# Altium project Visual_tactile.PrjPcb (part 3 of 3)

## Sheet memory.SchDoc
size A4; SheetNumber: 3; SheetTotal: 6
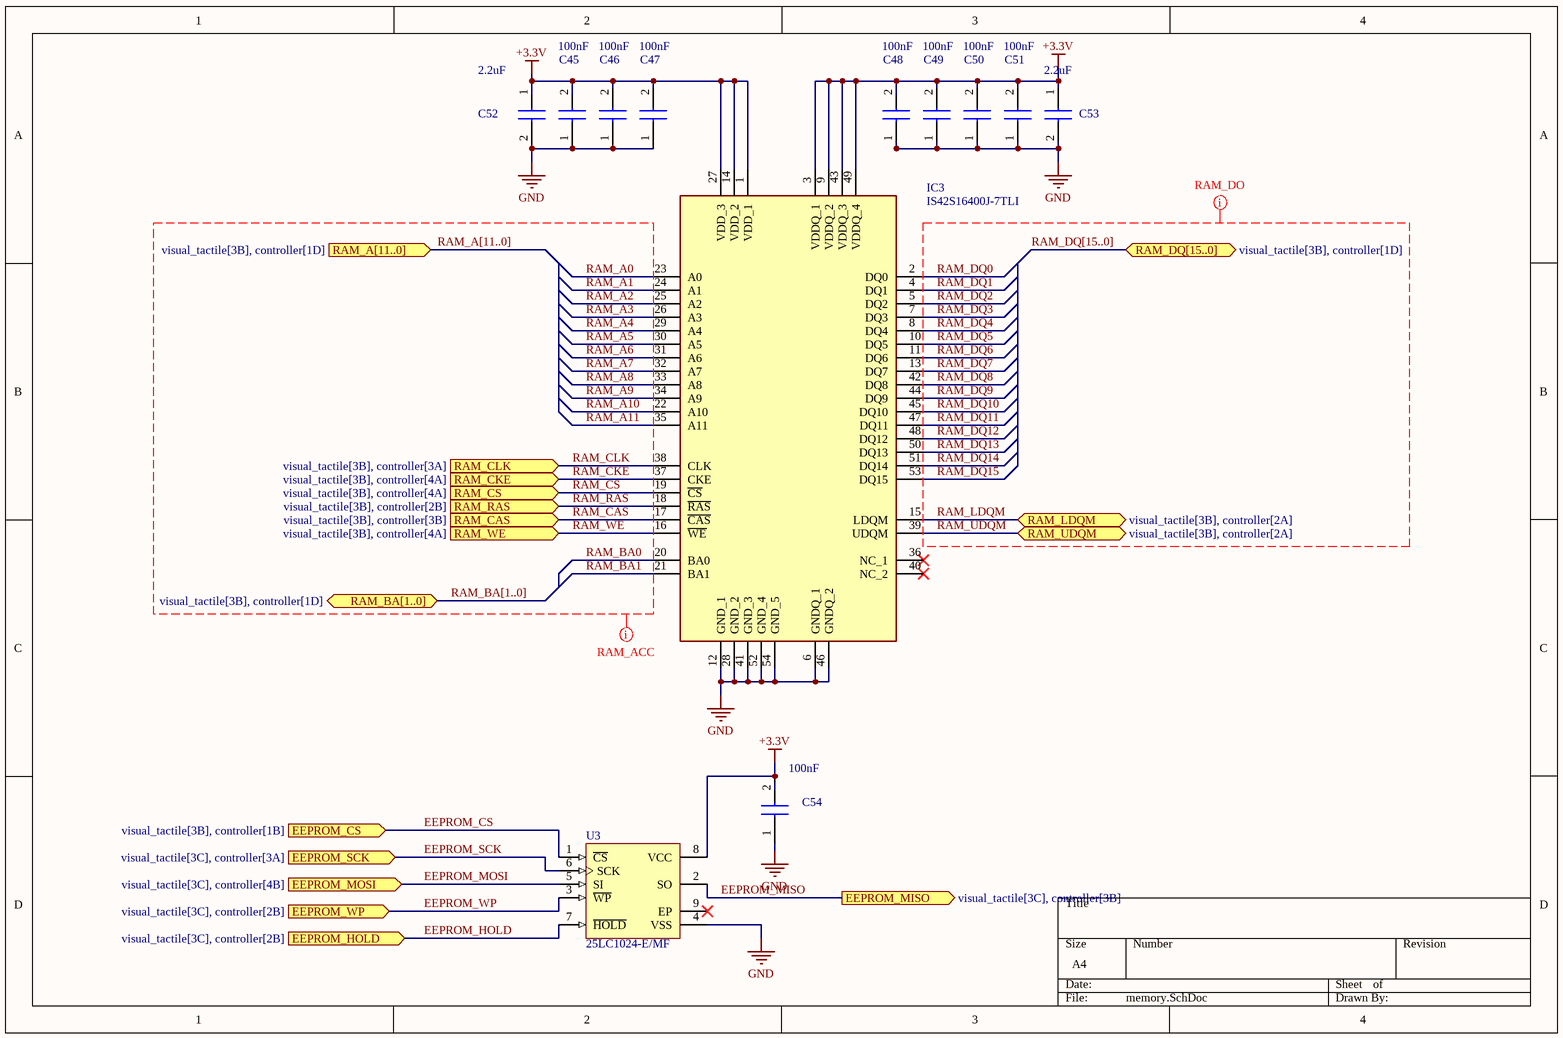
[diagram p5: memory.SchDoc]

### Parts
C45  value 100nF  [CAPC1608X87N]  (hidden comment: CGA3E2X7R1H104K080AA)
C46  value 100nF  [CAPC1608X87N]  (hidden comment: CGA3E2X7R1H104K080AA)
C47  value 100nF  [CAPC1608X87N]  (hidden comment: CGA3E2X7R1H104K080AA)
C48  value 100nF  [CAPC1608X87N]  (hidden comment: CGA3E2X7R1H104K080AA)
C49  value 100nF  [CAPC1608X87N]  (hidden comment: CGA3E2X7R1H104K080AA)
C50  value 100nF  [CAPC1608X87N]  (hidden comment: CGA3E2X7R1H104K080AA)
C51  value 100nF  [CAPC1608X87N]  (hidden comment: CGA3E2X7R1H104K080AA)
C52  value 2.2uF  [CAPC1608X87N]  (hidden comment: 06036C225KAT2A)
C53  value 2.2uF  [CAPC1608X87N]  (hidden comment: 06036C225KAT2A)
C54  value 100nF  [CAPC1608X87N]  (hidden comment: CGA3E2X7R1H104K080AA)
IC3  IS42S16400J-7TLI  [SOP80P1176X120-54N]
U3  25LC1024-E/MF  [DFNS-MF8]

### Ports
EEPROM_CS (in, see visual_tactile[3B], controller[1B]), EEPROM_HOLD (in, see visual_tactile[3C], controller[2B]), EEPROM_MISO (out, see visual_tactile[3C], controller[3B]), EEPROM_MOSI (in, see visual_tactile[3C], controller[4B]), EEPROM_SCK (in, see visual_tactile[3C], controller[3A]), EEPROM_WP (in, see visual_tactile[3C], controller[2B]), RAM_A[11..0] (in, see visual_tactile[3B], controller[1D]), RAM_BA[1..0] (bidir, see visual_tactile[3B], controller[1D]), RAM_CAS (in, see visual_tactile[3B], controller[3B]), RAM_CKE (in, see visual_tactile[3B], controller[4A]), RAM_CLK (in, see visual_tactile[3B], controller[3A]), RAM_CS (in, see visual_tactile[3B], controller[4A]), RAM_DQ[15..0] (bidir, see visual_tactile[3B], controller[1D]), RAM_LDQM (bidir, see visual_tactile[3B], controller[2A]), RAM_RAS (in, see visual_tactile[3B], controller[2B]), RAM_UDQM (bidir, see visual_tactile[3B], controller[2A]), RAM_WE (in, see visual_tactile[3B], controller[4A])

### Nets
+3.3V: C45.2 C46.2 C47.2 C48.2 C49.2 C50.2 C51.2 C52.1 C53.1 C54.2 IC3.1(VDD_1) IC3.3(VDDQ_1) IC3.9(VDDQ_2) IC3.14(VDD_2) IC3.27(VDD_3) IC3.43(VDDQ_3) IC3.49(VDDQ_4) U3.8(VCC)
GND: C45.1 C46.1 C47.1 C48.1 C49.1 C50.1 C51.1 C52.2 C53.2 C54.1 IC3.6(GNDQ_1) IC3.12(GND_1) IC3.28(GND_2) IC3.41(GND_3) IC3.46(GNDQ_2) IC3.52(GND_4) IC3.54(GND_5) U3.4(VSS)
EEPROM_CS: U3.1(~{CS}) ; port EEPROM_CS
EEPROM_HOLD: U3.7(~{HOLD}) ; port EEPROM_HOLD
EEPROM_MISO: U3.2(SO) ; port EEPROM_MISO
EEPROM_MOSI: U3.5(SI) ; port EEPROM_MOSI
EEPROM_SCK: U3.6(SCK) ; port EEPROM_SCK
EEPROM_WP: U3.3(~{WP}) ; port EEPROM_WP
RAM_A0: IC3.23(A0)
RAM_A1: IC3.24(A1)
RAM_A2: IC3.25(A2)
RAM_A3: IC3.26(A3)
RAM_A4: IC3.29(A4)
RAM_A5: IC3.30(A5)
RAM_A6: IC3.31(A6)
RAM_A7: IC3.32(A7)
RAM_A8: IC3.33(A8)
RAM_A9: IC3.34(A9)
RAM_A10: IC3.22(A10)
RAM_A11: IC3.35(A11)
RAM_BA0: IC3.20(BA0)
RAM_BA1: IC3.21(BA1)
RAM_CAS: IC3.17(~{CAS}) ; port RAM_CAS
RAM_CKE: IC3.37(CKE) ; port RAM_CKE
RAM_CLK: IC3.38(CLK) ; port RAM_CLK
RAM_CS: IC3.19(~{CS}) ; port RAM_CS
RAM_DQ0: IC3.2(DQ0)
RAM_DQ1: IC3.4(DQ1)
RAM_DQ2: IC3.5(DQ2)
RAM_DQ3: IC3.7(DQ3)
RAM_DQ4: IC3.8(DQ4)
RAM_DQ5: IC3.10(DQ5)
RAM_DQ6: IC3.11(DQ6)
RAM_DQ7: IC3.13(DQ7)
RAM_DQ8: IC3.42(DQ8)
RAM_DQ9: IC3.44(DQ9)
RAM_DQ10: IC3.45(DQ10)
RAM_DQ11: IC3.47(DQ11)
RAM_DQ12: IC3.48(DQ12)
RAM_DQ13: IC3.50(DQ13)
RAM_DQ14: IC3.51(DQ14)
RAM_DQ15: IC3.53(DQ15)
RAM_LDQM: IC3.15(LDQM) ; port RAM_LDQM
RAM_RAS: IC3.18(~{RAS}) ; port RAM_RAS
RAM_UDQM: IC3.39(UDQM) ; port RAM_UDQM
RAM_WE: IC3.16(~{WE}) ; port RAM_WE

Not connected (* = marked no-connect by the designer): IC3 36(NC_1)* 40(NC_2)*; U3 9(EP)*

### Buses and harness runs
bus RAM_A[11..0] =  = port RAM_A[11..0]
bus RAM_BA[1..0] = port RAM_BA[1..0]
bus RAM_DQ[15..0] = port RAM_DQ[15..0]

### Layout directives
net class RAM_ACC; rule Matched Net Lengths [Delay Tolerance = 100ps]: RAM_A0, RAM_A1, RAM_A2, RAM_A3, RAM_A4, RAM_A5, RAM_A6, RAM_A7, RAM_A8, RAM_A9, RAM_A10, RAM_A11, RAM_A[11..0], RAM_BA0, RAM_BA1, RAM_BA[1..0], RAM_CAS, RAM_CKE, RAM_CLK, RAM_CS, RAM_RAS, RAM_WE
net class RAM_D; rule Matched Net Lengths [Delay Tolerance = 100ps]: RAM_DQ0, RAM_DQ1, RAM_DQ2, RAM_DQ3, RAM_DQ4, RAM_DQ5, RAM_DQ6, RAM_DQ7, RAM_DQ8, RAM_DQ9, RAM_DQ10, RAM_DQ11, RAM_DQ12, RAM_DQ13, RAM_DQ14, RAM_DQ15, RAM_DQ[15..0], RAM_LDQM, RAM_UDQM

### Library data of the parts
C45-C51 C54 = C0603C300J5GACTU: Ceramic Capacitor, Multilayer, Ceramic, 50V, 10% +Tol, 10% -Tol, X7R, 15% TC, 0.1uF, Surface Mount, 0603; Manufacturer_Name: KEMET; Manufacturer: TDK; Multilayer: Yes; Reference Standard: AEC-Q200; Datasheet Link: https://content.kemet.com/datasheets/KEM_C1003_C0G_SMD.pdf; Height: 0.87mm; Manufacturer_Part_Number: C0603C300J5GACTU; Mouser Part Number: 80-C0603C300J5G; Mouser Price/Stock: https://www.mouser.co.uk/ProductDetail/KEMET/C0603C300J5GACTU?qs=KQYYlyH3z3RpeXhtJmCcMA%3D%3D; Arrow Part Number: C0603C300J5GACTU; Arrow Price/Stock: https://www.arrow.com/en/products/c0603c300j5gactu/kemet-corporation; Supplier: Rs; Supplier Part Number: 7882985P; Manufacturer Part Number: CGA3E2X7R1H104K080AA; RoHS: Yes; Category: Ceramic Capacitors; Stock: 84850; Pricing: 250=0.042, 500=0.039, 1000=0.037, 2500=0.033 (EUR); Mounting Technology: Surface Mount; Pins: 2; Dielectric Material: Ceramic; Package Shape: Rectangular; Case/Package: 0603; Terminal Finish: Nickel; Min Operating Temperature: -55°C; Max Operating Temperature: 125°C; JESD-609 Code: e3; Capacitor Type: Ceramic; Tolerance  (fill in as +-): 10%; Package Style: SMTMeter; Packaging: Tape and Reel; Tolerance (fill in as +-): 10%; Rated DC Voltage (URdc): 50V; Temperature Characteristics Code: X7R; Termination: Wraparound; Length: 1.6mm; Width: 0.8mm; Reach SVHC Compliant: Yes; RoHS Compliant: Yes; ComponentLink1URL: https://datasheet.ciiva.com:443/pdfs/VipMasterIC/IC/TDKC/TDKC-S-A0008953915/TDKC-S-A0008953915-1.pdf?src-supplier=IHS+Markit; ComponentLink1Description: https://datasheet.ciiva.com:443/pdfs/VipMasterIC/IC/TDKC/TDKC-S-A0008953915/TDKC-S-A0008953915-1.pdf?src-supplier=IHS+Markit
C52 C53 = C0603C300J5GACTU: Ceramic Capacitor, Multilayer, Ceramic, 6.3V, 10% +Tol, 10% -Tol, X7R, 15% TC, 2.2uF, Surface Mount, 0603; Manufacturer_Name: KEMET; Manufacturer Part Number: C0603C225K4PACTU; Description: Ceramic Capacitor, Multilayer, Ceramic, 16V, 10% +Tol, 10% -Tol, X5R, 15% TC, 2.2uF, Surface Mount, 0603; Multilayer: Yes; Rated DC Voltage (URdc): 16V; Temperature Characteristics Code: X5R; Datasheet Link: https://content.kemet.com/datasheets/KEM_C1003_C0G_SMD.pdf; Height: 0.87mm; Manufacturer_Part_Number: C0603C300J5GACTU; Mouser Part Number: 80-C0603C300J5G; Mouser Price/Stock: https://www.mouser.co.uk/ProductDetail/KEMET/C0603C300J5GACTU?qs=KQYYlyH3z3RpeXhtJmCcMA%3D%3D; Arrow Part Number: C0603C300J5GACTU; Arrow Price/Stock: https://www.arrow.com/en/products/c0603c300j5gactu/kemet-corporation; Supplier: Mouser; Supplier Part Number: 80-C0603C225K4P; Manufacturer: KEMET; RoHS: Yes; Category: Ceramic Capacitors; Stock: 124128; Pricing: 1=0.12, 10=0.049, 50=0.049, 100=0.029, 1000=0.024, 10000=0.022 (USD); Mounting Technology: Surface Mount; Pins: 2; Dielectric Material: Ceramic; Package Shape: Rectangular; Case/Package: 0603; Terminal Finish: Nickel; Min Operating Temperature: -55°C; Max Operating Temperature: 85°C; JESD-609 Code: e3; Capacitor Type: Ceramic; Tolerance  (fill in as +-): 10%; Package Style: SMTMeter; Packaging: Tape and Reel; Tolerance (fill in as +-): 10%; Termination: Wraparound; Length: 1.6mm; Width: 0.8mm; Reach SVHC Compliant: Yes; RoHS Compliant: Yes; ComponentLink1URL: https://datasheet.ciiva.com:443/pdfs/VipMasterIC/IC/KEME/KEME-S-A0008991665/KEME-S-A0008991665-1.pdf?src-supplier=IHS+Markit; ComponentLink1Description: https://datasheet.ciiva.com:443/pdfs/VipMasterIC/IC/KEME/KEME-S-A0008991665/KEME-S-A0008991665-1.pdf?src-supplier=IHS+Markit; ComponentLink2URL: https://datasheet.ciiva.com:443/pdfs/VipMasterIC/IC/AVXC/AVXC-S-A0009640452/AVXC-S-A0009640452-1.pdf?src-supplier=IHS+Markit; ComponentLink2Description: https://datasheet.ciiva.com:443/pdfs/VipMasterIC/IC/AVXC/AVXC-S-A0009640452/AVXC-S-A0009640452-1.pdf?src-supplier=IHS+Markit
IC3 = IS42S16400J-7TLI: Integrated Circuit; Manufacturer_Name: Integrated Silicon Solution Inc.; Datasheet Link: http://www.issi.com/WW/pdf/42-45S16400J.pdf; Height: 1.2mm; Manufacturer_Part_Number: IS42S16400J-7TLI; Mouser Part Number: 870-IS42S16400J-7TLI; Mouser Price/Stock: https://www.mouser.co.uk/ProductDetail/ISSI/IS42S16400J-7TLI?qs=eOmjsnl%2FhF6IYGbICFWNhg%3D%3D; Arrow Part Number: IS42S16400J-7TLI; Arrow Price/Stock: https://www.arrow.com/en/products/is42s16400j-7tli/integrated-silicon-solution-inc?region=europe
U3 = CMP-0165-00187-2: 1 Mbit SPI Bus Serial EEPROM, 8-Pin DFN, Extended Temperature; PackageVersion: revBB, Aug-2009; PackageDescription: 8-Lead Plastic Dual Flat, No Lead Package (MF) - 6x5 mm Body [DFN-S]; PackageReference: DFNS-MF8; DatasheetVersion: revC, Oct-2008

## Nets that join several sheets
+3.3V: visual_tactile (C4.2 C5.2 R1.2 U1.2), controller (29 pins), ethernet (5 pins), camera (19 pins), sensors_and_led (8 pins), memory (18 pins)
+5V: visual_tactile (5 pins), sensors_and_led (7 pins)
GND: visual_tactile (10 pins), controller (40 pins), ethernet (21 pins), camera (25 pins), sensors_and_led (8 pins), memory (18 pins)
CAM_D0: controller (U2.101), camera (J3.19)
CAM_D1: controller (U2.97), camera (J3.21)
CAM_D2: controller (U2.98), camera (J3.22)
CAM_D3: controller (U2.126), camera (J3.20)
CAM_D4: controller (U2.3), camera (J3.18)
CAM_D5: controller (U2.117), camera (J3.16)
CAM_D6: controller (U2.4), camera (J3.14)
CAM_D7: controller (U2.5), camera (J3.12)
CAM_HSYNC: controller (U2.40), camera (J3.9)
CAM_PCLK: controller (U2.42), camera (J3.17)
CAM_PWDN: controller (U2.119), camera (J3.8 R10.2)
CAM_RESET: controller (U2.122), camera (C44.2 J3.6 R9.1)
CAM_SCL: controller (U2.136), camera (J3.5 R7.1)
CAM_SDA: controller (U2.140), camera (J3.3 R8.1)
CAM_VSYNC: controller (U2.124), camera (J3.7)
CAM_XCLK: controller (TP1.1 U2.37), camera (JP1.1)
EEPROM_CS: controller (SB1.2 U2.18), memory (U3.1)
EEPROM_HOLD: controller (U2.20), memory (U3.7)
EEPROM_MISO: controller (U2.134), memory (U3.2)
EEPROM_MOSI: controller (U2.123), memory (U3.5)
EEPROM_SCK: controller (U2.41), memory (U3.6)
EEPROM_WP: controller (U2.19), memory (U3.3)
NetR41_1: controller (U2.46), sensors_and_led (R41.1)
NetR42_1: controller (U2.47), sensors_and_led (R42.1)
NetR43_1: controller (U2.135), sensors_and_led (R43.1)
NetR44_1: controller (U2.96), sensors_and_led (R44.1)
NRST: controller (J2.12 S1.1 U2.25), ethernet (IC4.15)
RAM_A0: controller (U2.10), memory (IC3.23)
RAM_A1: controller (U2.11), memory (IC3.24)
RAM_A2: controller (U2.12), memory (IC3.25)
RAM_A3: controller (U2.13), memory (IC3.26)
RAM_A4: controller (U2.14), memory (IC3.29)
RAM_A5: controller (U2.15), memory (IC3.30)
RAM_A6: controller (U2.50), memory (IC3.31)
RAM_A7: controller (U2.53), memory (IC3.32)
RAM_A8: controller (U2.54), memory (IC3.33)
RAM_A9: controller (U2.55), memory (IC3.34)
RAM_A10: controller (U2.56), memory (IC3.22)
RAM_A11: controller (U2.57), memory (IC3.35)
RAM_BA0: controller (U2.89), memory (IC3.20)
RAM_BA1: controller (U2.90), memory (IC3.21)
RAM_CAS: controller (U2.132), memory (IC3.17)
RAM_CKE: controller (U2.29), memory (IC3.37)
RAM_CLK: controller (U2.93), memory (IC3.38)
RAM_CS: controller (U2.28), memory (IC3.19)
RAM_DQ0: controller (U2.85), memory (IC3.2)
RAM_DQ1: controller (U2.86), memory (IC3.4)
RAM_DQ2: controller (U2.114), memory (IC3.5)
RAM_DQ3: controller (U2.115), memory (IC3.7)
RAM_DQ4: controller (U2.58), memory (IC3.8)
RAM_DQ5: controller (U2.59), memory (IC3.10)
RAM_DQ6: controller (U2.60), memory (IC3.11)
RAM_DQ7: controller (U2.63), memory (IC3.13)
RAM_DQ8: controller (U2.64), memory (IC3.42)
RAM_DQ9: controller (U2.65), memory (IC3.44)
RAM_DQ10: controller (U2.66), memory (IC3.45)
RAM_DQ11: controller (U2.67), memory (IC3.47)
RAM_DQ12: controller (U2.68), memory (IC3.48)
RAM_DQ13: controller (U2.77), memory (IC3.50)
RAM_DQ14: controller (U2.78), memory (IC3.51)
RAM_DQ15: controller (U2.79), memory (IC3.53)
RAM_LDQM: controller (U2.141), memory (IC3.15)
RAM_RAS: controller (U2.49), memory (IC3.18)
RAM_UDQM: controller (U2.142), memory (IC3.39)
RAM_WE: controller (U2.26), memory (IC3.16)
RMII_CRS_DV: controller (U2.43), ethernet (IC4.11)
RMII_MDC: controller (U2.27), ethernet (IC4.13)
RMII_MDIO: controller (U2.36), ethernet (IC4.12 R21.2)
RMII_REF_CLK: controller (U2.35), ethernet (R23.1)
RMII_RXD0: controller (U2.44), ethernet (R15.1)
RMII_RXD1: controller (U2.45), ethernet (R16.1)
RMII_TX_EN: controller (U2.70), ethernet (IC4.16)
RMII_TXD0: controller (U2.73), ethernet (IC4.17)
RMII_TXD1: controller (U2.74), ethernet (IC4.18)
SEN_SCL: controller (U2.100), sensors_and_led (5 pins)
SEN_SDA: controller (U2.99), sensors_and_led (5 pins)